# Altium schematic sheet BaseBoard.SchDoc
size B
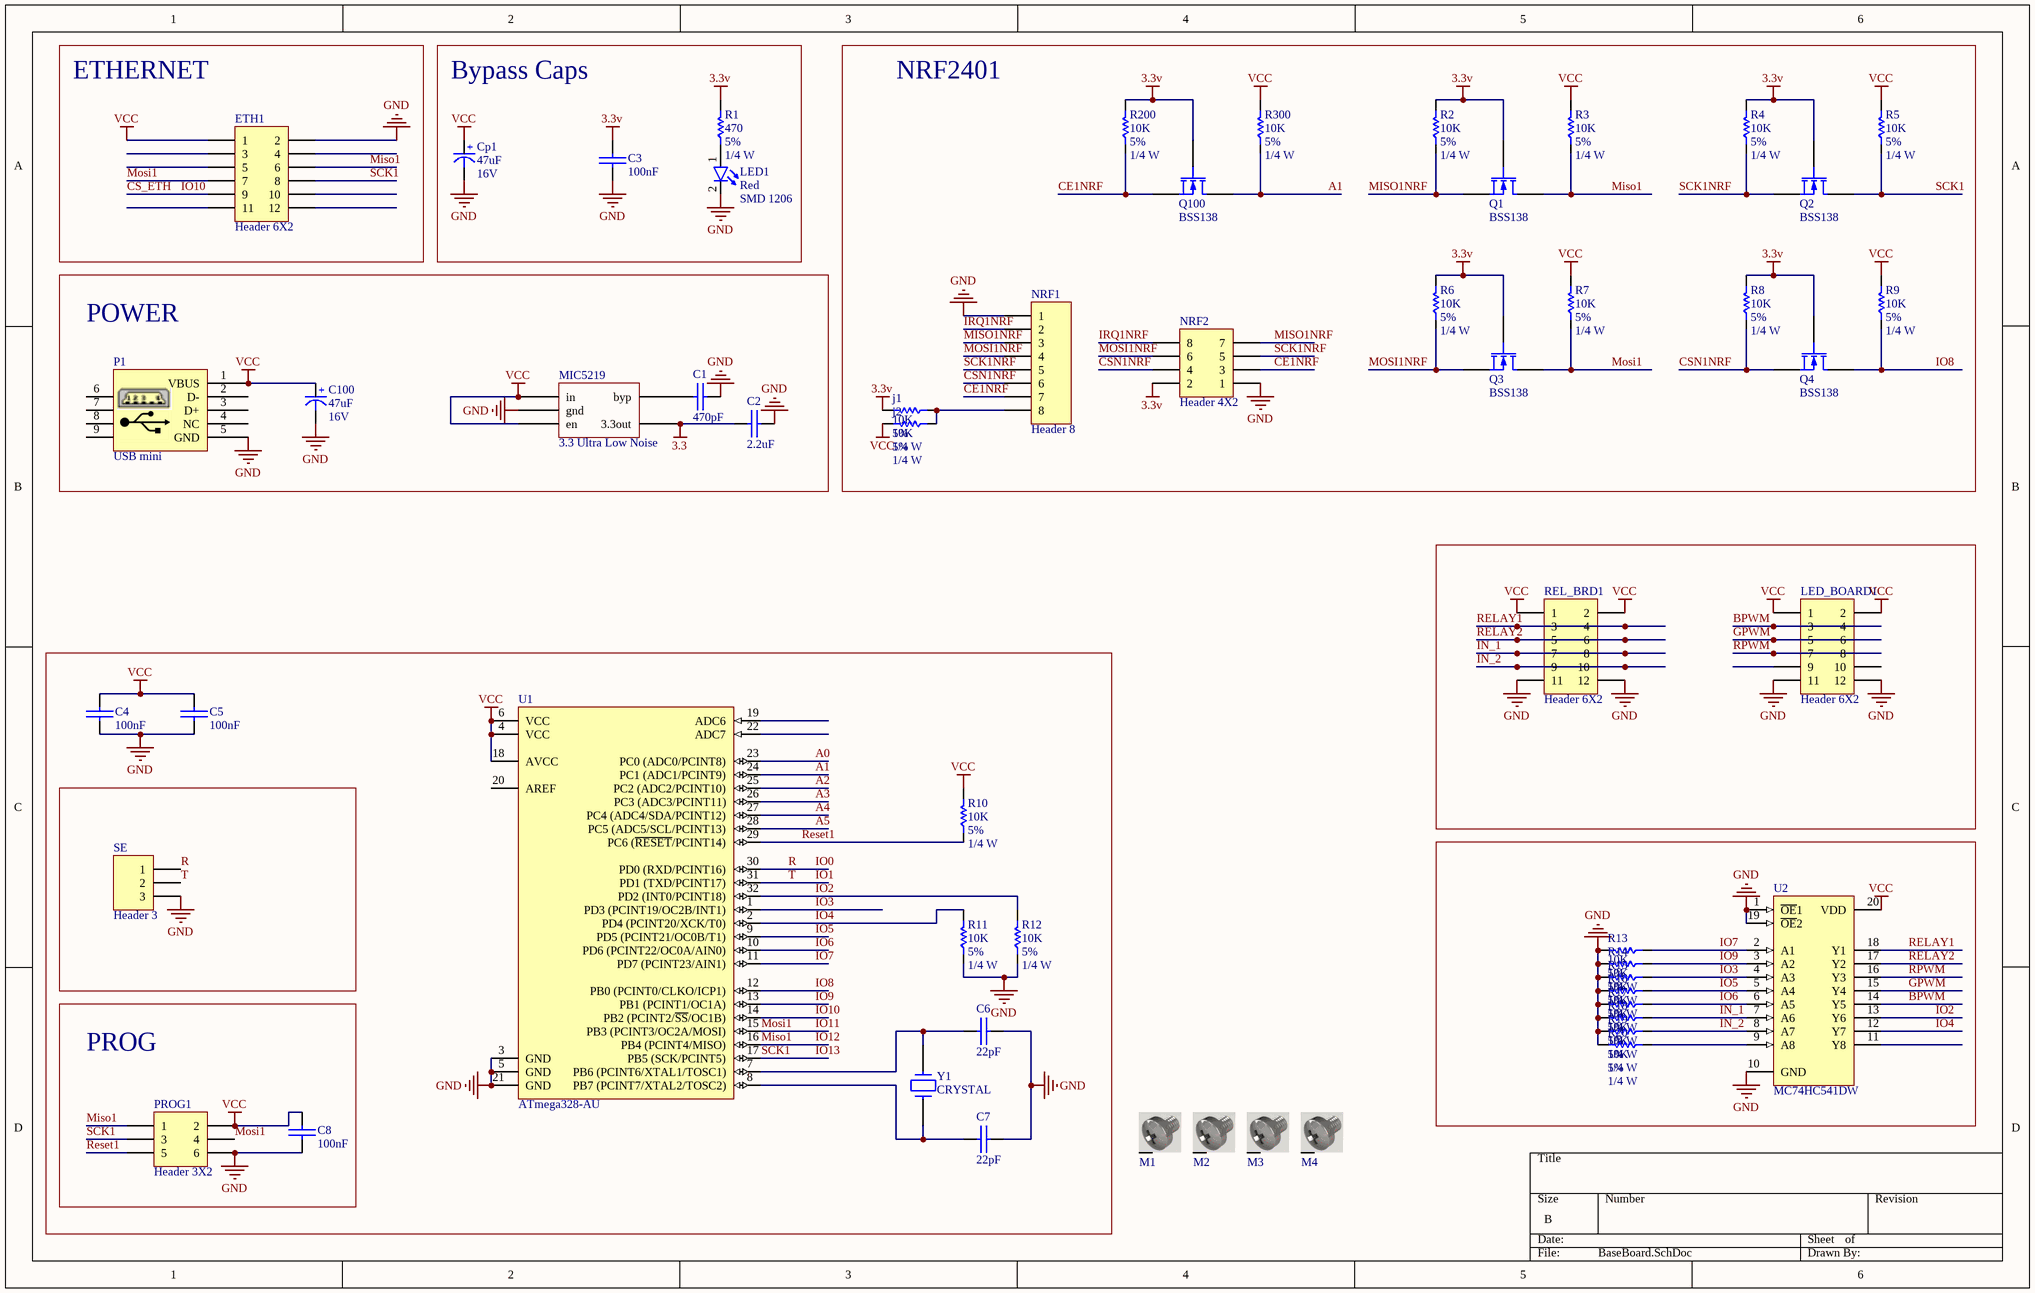
[diagram p0: BaseBoard.SchDoc]

## Parts
C1  470pF  [SMD_CAP_0805]
C2  2.2uF  [SMD_CAP_1206]
C3  100nF  [CAPP 1206 (3216X18L) Size A]
C4  100nF  [CAPP 1206 (3216X18L) Size A]
C5  100nF  [CAPP 1206 (3216X18L) Size A]
C6  22pF  [CAPP 1206 (3216X18L) Size A]
C7  22pF  [CAPP 1206 (3216X18L) Size A]
C8  100nF  [CAPP 1206 (3216X18L) Size A]
C100  Voltage: 16V  [CAPP 1206 (3216X18L) Size A]  (hidden comment: 47uF)
Cp1  Voltage: 16V  [CAPP 1206 (3216X18L) Size A]  (hidden comment: 47uF)
ETH1  Header 6X2  [HDR2X6]
j1  Tolerance: 5%  Power: 1/4 W  [RES 1206 (3216X08L)]  (hidden comment: 10K)
j2  Tolerance: 5%  Power: 1/4 W  [RES 1206 (3216X08L)]  (hidden comment: 10K)
LED1  Size: SMD 1206  [LED SMD 1206]  (hidden comment: Red)
LED_BOARD1  Header 6X2  [HDR2X6]
M1  Screw  [Board Screw_No Silk]  (value not drawn)
M2  Screw  [Board Screw_No Silk]  (value not drawn)
M3  Screw  [Board Screw_No Silk]  (value not drawn)
M4  Screw  [Board Screw_No Silk]  (value not drawn)
MIC5219  3.3 Ultra Low Noise  [mic5205]
NRF1  Header 8  [HDR1X8]
NRF2  Header 4X2  [HDR2X4]
P1  USB mini  [USB/SM0.8-6H5]
PROG1  Header 3X2  [HDR2X3]
Q1  BSS138  [SOT23]
Q2  BSS138  [SOT23]
Q3  BSS138  [SOT23]
Q4  BSS138  [SOT23]
Q100  BSS138  [SOT23]
R1  Tolerance: 5%  Power: 1/4 W  [RES 1206 (3216X08L)]  (hidden comment: 470)
R2  Tolerance: 5%  Power: 1/4 W  [RES 1206 (3216X08L)]  (hidden comment: 10K)
R3  Tolerance: 5%  Power: 1/4 W  [RES 1206 (3216X08L)]  (hidden comment: 10K)
R4  Tolerance: 5%  Power: 1/4 W  [RES 1206 (3216X08L)]  (hidden comment: 10K)
R5  Tolerance: 5%  Power: 1/4 W  [RES 1206 (3216X08L)]  (hidden comment: 10K)
R6  Tolerance: 5%  Power: 1/4 W  [RES 1206 (3216X08L)]  (hidden comment: 10K)
R7  Tolerance: 5%  Power: 1/4 W  [RES 1206 (3216X08L)]  (hidden comment: 10K)
R8  Tolerance: 5%  Power: 1/4 W  [RES 1206 (3216X08L)]  (hidden comment: 10K)
R9  Tolerance: 5%  Power: 1/4 W  [RES 1206 (3216X08L)]  (hidden comment: 10K)
R10  Tolerance: 5%  Power: 1/4 W  [RES 1206 (3216X08L)]  (hidden comment: 10K)
R11  Tolerance: 5%  Power: 1/4 W  [RES 1206 (3216X08L)]  (hidden comment: 10K)
R12  Tolerance: 5%  Power: 1/4 W  [RES 1206 (3216X08L)]  (hidden comment: 10K)
R13  Tolerance: 5%  Power: 1/4 W  [RES 1206 (3216X08L)]  (hidden comment: 10K)
R14  Tolerance: 5%  Power: 1/4 W  [RES 1206 (3216X08L)]  (hidden comment: 10K)
R15  Tolerance: 5%  Power: 1/4 W  [RES 1206 (3216X08L)]  (hidden comment: 10K)
R16  Tolerance: 5%  Power: 1/4 W  [RES 1206 (3216X08L)]  (hidden comment: 10K)
R17  Tolerance: 5%  Power: 1/4 W  [RES 1206 (3216X08L)]  (hidden comment: 10K)
R18  Tolerance: 5%  Power: 1/4 W  [RES 1206 (3216X08L)]  (hidden comment: 10K)
R19  Tolerance: 5%  Power: 1/4 W  [RES 1206 (3216X08L)]  (hidden comment: 10K)
R20  Tolerance: 5%  Power: 1/4 W  [RES 1206 (3216X08L)]  (hidden comment: 10K)
R200  Tolerance: 5%  Power: 1/4 W  [RES 1206 (3216X08L)]  (hidden comment: 10K)
R300  Tolerance: 5%  Power: 1/4 W  [RES 1206 (3216X08L)]  (hidden comment: 10K)
REL_BRD1  Header 6X2  [HDR2X6]
SE  Header 3  [HDR1X3]
U1  ATmega328-AU  [32A_N]
U2  MC74HC541DW  [751D-03_N]
Y1  CRYSTAL  [My_Crystal]

## Blocks framed on the sheet
ETHERNET: ETH1
Bypass Caps: C3 Cp1 LED1 R1
NRF2401: j1 j2 NRF1 NRF2 Q1-Q4 Q100 R2-R9 R200 R300
POWER: C1 C2 C100 MIC5219 P1
PROG: C8 PROG1

## Nets
3.3: C2.1(+) MIC5219.5(3.3out)
3.3v: C3.2(-) j1.2 NRF2.2 Q1.3(G) Q2.3(G) Q3.3(G) Q4.3(G) Q100.3(G) R1.2 R2.2 R4.2 R6.2 R8.2 R200.2
GND: C1.2(-) C2.2(-) C3.1(+) C4.1(+) C5.1(+) C6.2(-) C7.1(+) C8.1(+) C100.2(-) Cp1.2(-) ETH1.2 LED1.2(K) LED_BOARD1.11 LED_BOARD1.12 MIC5219.2(gnd) NRF1.1 NRF2.1 P1.5(GND) PROG1.6 R11.1 R12.1 R13.2 R14.2 R15.2 R16.2 R17.2 R18.2 R19.2 R20.2 REL_BRD1.11 REL_BRD1.12 SE.3 U1.3(GND) U1.5(GND) U1.21(GND) U2.1(~{OE}1) U2.10(GND) U2.19(~{OE}2)
VCC: C4.2(-) C5.2(-) C8.2(-) C100.1(+) Cp1.1(+) ETH1.1 j2.2 LED_BOARD1.1 LED_BOARD1.2 MIC5219.1(in) MIC5219.3(en) P1.1(VBUS) PROG1.2 R3.2 R5.2 R7.2 R9.2 R10.2 R300.2 REL_BRD1.1 REL_BRD1.2 U1.4(VCC) U1.6(VCC) U1.18(AVCC) U2.20(VDD)
A0: U1.23(PC0_(ADC0/PCINT8))
A1: Q100.1(D) R300.1 U1.24(PC1_(ADC1/PCINT9))
A2: U1.25(PC2_(ADC2/PCINT10))
A3: U1.26(PC3_(ADC3/PCINT11))
A4: U1.27(PC4_(ADC4/SDA/PCINT12))
A5: U1.28(PC5_(ADC5/SCL/PCINT13))
BPWM: LED_BOARD1.3 LED_BOARD1.4 U2.14(Y5)
CE1NRF: NRF1.7 NRF2.3 Q100.2(S) R200.1
CS_ETH: ETH1.9 U1.14(PB2_(PCINT2/~{SS}/OC1B))  [also labelled IO10]
CSN1NRF: NRF1.6 NRF2.4 Q4.2(S) R8.1
GPWM: LED_BOARD1.5 LED_BOARD1.6 U2.15(Y4)
IN_1: R18.1 REL_BRD1.7 REL_BRD1.8 U2.7(A6)
IN_2: R19.1 REL_BRD1.9 REL_BRD1.10 U2.8(A7)
IO0: SE.1 U1.30(PD0_(RXD/PCINT16))  [also labelled R]
IO1: SE.2 U1.31(PD1_(TXD/PCINT17))  [also labelled T]
IO2: R12.2 U1.32(PD2_(INT0/PCINT18)) U2.13(Y6)
IO3: R15.1 U1.1(PD3_(PCINT19/OC2B/INT1)) U2.4(A3)
IO4: R11.2 U1.2(PD4_(PCINT20/XCK/T0)) U2.12(Y7)
IO5: R16.1 U1.9(PD5_(PCINT21/OC0B/T1)) U2.5(A4)
IO6: R17.1 U1.10(PD6_(PCINT22/OC0A/AIN0)) U2.6(A5)
IO7: R13.1 U1.11(PD7_(PCINT23/AIN1)) U2.2(A1)
IO8: Q4.1(D) R9.1 U1.12(PB0_(PCINT0/CLKO/ICP1))
IO9: R14.1 U1.13(PB1_(PCINT1/OC1A)) U2.3(A2)
IO11: ETH1.7 PROG1.4 Q3.1(D) R7.1 U1.15(PB3_(PCINT3/OC2A/MOSI))  [also labelled Mosi1]
IO12: ETH1.6 PROG1.1 Q1.1(D) R3.1 U1.16(PB4_(PCINT4/MISO))  [also labelled Miso1]
IO13: ETH1.8 PROG1.3 Q2.1(D) R5.1 U1.17(PB5_(SCK/PCINT5))  [also labelled SCK1]
IRQ1NRF: NRF1.2 NRF2.8
MISO1NRF: NRF1.3 NRF2.7 Q1.2(S) R2.1
MOSI1NRF: NRF1.4 NRF2.6 Q3.2(S) R6.1
RELAY1: REL_BRD1.3 REL_BRD1.4 U2.18(Y1)
RELAY2: REL_BRD1.5 REL_BRD1.6 U2.17(Y2)
Reset1: PROG1.5 R10.1 U1.29(PC6_(~{RESET}/PCINT14))
RPWM: LED_BOARD1.7 LED_BOARD1.8 U2.16(Y3)
SCK1NRF: NRF1.5 NRF2.5 Q2.2(S) R4.1
NetC1_1: C1.1(+) MIC5219.4(byp)
NetC6_1: C6.1(+) U1.7(PB6_(PCINT6/XTAL1/TOSC1)) Y1.2
NetC7_2: C7.2(-) U1.8(PB7_(PCINT7/XTAL2/TOSC2)) Y1.1
Netj1_1: j1.1 j2.1 NRF1.8
NetLED1_1: LED1.1(A) R1.1
NetR20_1: R20.1 U2.9(A8)

Not connected (* = marked no-connect by the designer): ETH1 3 4 5 10 11 12; LED_BOARD1 9 10; M1 S; M2 S; M3 S; M4 S; P1 2(D-) 3(D+) 4(NC) 6 7 8 9; U1 19(ADC6) 20(AREF) 22(ADC7); U2 11(Y8)

## Library data of the parts
C1-C8 = Cap-Bipolar: Bipolar Capacitor; Voltage: 100V; Designer: Saeid Jorablo; Organazation: ControTec; Adding Date: 1387/12/20
  C1: Value: 470pF
  C2: Value: 2.2uF
  C3-C5 C8: Value: 100nF
  C6 C7: Value: 22pF
C100 Cp1 = Cap-Polar: Polar Capacitor; Designer: Saeid Jorablo; Organazation: ControTec; Adding Date: 1387/12/20; Value: 47uF
ETH1 LED_BOARD1 REL_BRD1 = Header 6X2: Header, 6-Pin, Dual row; Revision: 17-Jul-2002: Re-released for DXP Platform.; Publisher: Altium Limited
j1 j2 R1-R20 R200 R300 = Resistor
  j1 j2 R2-R20 R200 R300: Value: 10K
  R1: Value: 470
LED1 = LED: Designer: Saeid Jorablo; Organazation: ControTec; Adding Date: 1387/12/22; Color: Red
M1-M4 = Board Screw: Board Screw With Spacer
MIC5219 = Component_1
NRF1 = Header 8: Header, 8-Pin; Revision: 17-Jul-2002: Re-released for DXP Platform.; Publisher: Altium Limited
NRF2 = Header 4X2: Header, 4-Pin, Dual row; Revision: 17-Jul-2002: Re-released for DXP Platform.; Publisher: Altium Limited
P1 = USB mini: mini USB Connector
PROG1 = Header 3X2: Header, 3-Pin, Dual row; LatestRevisionDate: 17-Jul-2002; LatestRevisionNote: Re-released for DXP Platform.; Publisher: Altium Limited
Q1-Q4 Q100 = BSS138: N-Channel Enhancement Mode Vertical DMOS FET; Published: 17-Dec-2003; DatasheetVersion: Mar-96; PackageVersion: 1996; PackageReference: SOT23; Publisher: Altium Limited; PackageDescription: SOT-23; 3 Leads; Body 3.1 x 2.5 mm, inc. leads (LxW max), Alternate Lead Configuration; ComponentLink1Description: Manufacturer Link; ComponentLink1URL: http://www.zetex.com/; ComponentLink2Description: Datasheet; ComponentLink2URL: www.zetex.com/3.0/pdf/BSS138.pdf
SE = Header 3: Header, 3-Pin; Revision: 17-Jul-2002: Re-released for DXP Platform.; Publisher: Altium Limited
U1 = ATmega328-AU: 8-bit AVR Microcontroller, 32KB Flash, 1KB EEPROM, 2KB SRAM, 32-pin TQFP, Industrial Grade (-40°C to 85°C); Published: 1-Apr-2010; DatasheetVersion: revA, Jan-2010; PackageVersion: revB, Oct-2001; PackageReference: 32A; Publisher: Altium Limited; PackageDescription: 32-Lead, 7x7x1.0 mm Body, 0.8mm Lead Pitch, Thin Profile Plastic Quad Flat Package (TQFP); Supplier 1: Digi-Key; Supplier Part Number 1: ATMEGA328-AU-ND; Supplier 2: Mouser; Supplier Part Number 2: 556-ATMEGA328-AU; Code_JEDEC: MS-026-ABA; ComponentLink1Description: Manufacturer Link; ComponentLink1URL: http://www.atmel.com/products/avr/default.asp?; ComponentLink2Description: ATmega48A/48PA/88A/88PA/168A/168PA/328/328P Datasheet; ComponentLink2URL: http://www.atmel.com/dyn/resources/prod_documents/8271.pdf; ComponentLink3Description: ATmega48A/48PA/88A/88PA/168A/168PA/328/328P Summary; ComponentLink3URL: http://www.atmel.com/dyn/resources/prod_documents/8271S.pdf; ComponentLink4Description: Atmel.com Home; ComponentLink4URL: http://www.atmel.com
U2 = MC74HC541DW: Octal 3-State Non-Inverting Buffer/Line Driver/Line Receiver; Published: 17-Jul-2002; LatestRevisionDate: 13-Apr-2006; LatestRevisionNote: IPC-7351 Footprint Added.; DatasheetVersion: 1989; PackageReference: 751D-03; Publisher: Altium Limited; PackageDescription: 20-Pin Small Outline Integrated Circuit 1.27 mm Pitch; ComponentLink1Description: Manufacturer Link; ComponentLink1URL: http://www.onsemi.com/site/products/parametrics/0,4446,178,00.html